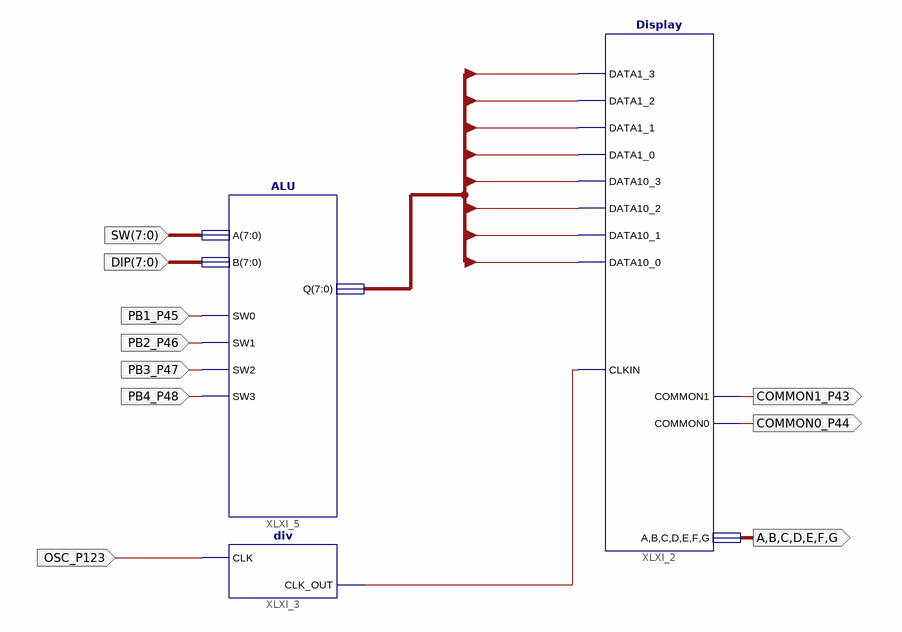
[diagram p0: schematic sheet 1]
// Xilinx ISE schematic Lab09.sch (spartan6) as structural Verilog: 3 symbols, 10 ports
module Lab09 (
  input  [7:0] SW,
  input  [7:0] DIP,
  input  OSC_P123,
  input  PB1_P45,
  input  PB2_P46,
  input  PB3_P47,
  input  PB4_P48,
  output COMMON1_P43,
  output COMMON0_P44,
  output A,
  output B,
  output C,
  output D,
  output E,
  output F,
  output G
);

  wire XLXN_13;
  wire [7:0] Q;

  Display XLXI_2 (
    .CLKIN(XLXN_13), .DATA1_0(Q[0]), .DATA10_0(Q[4]), .DATA1_1(Q[1]), .DATA10_1(Q[5]), .DATA1_2(Q[2]),
    .DATA10_2(Q[6]), .DATA1_3(Q[3]), .DATA10_3(Q[7]), .COMMON1(COMMON1_P43), .COMMON0(COMMON0_P44), .A(A),
    .B(B), .C(C), .D(D), .E(E), .F(F), .G(G));
  div XLXI_3 (.CLK(OSC_P123), .CLK_OUT(XLXN_13));
  ALU XLXI_5 (.B(DIP), .A(SW), .SW0(PB1_P45), .SW1(PB2_P46), .SW2(PB3_P47), .SW3(PB4_P48), .Q(Q));
endmodule
